# EAGLE design S0_2te3.0a (EAGLE 5.06)
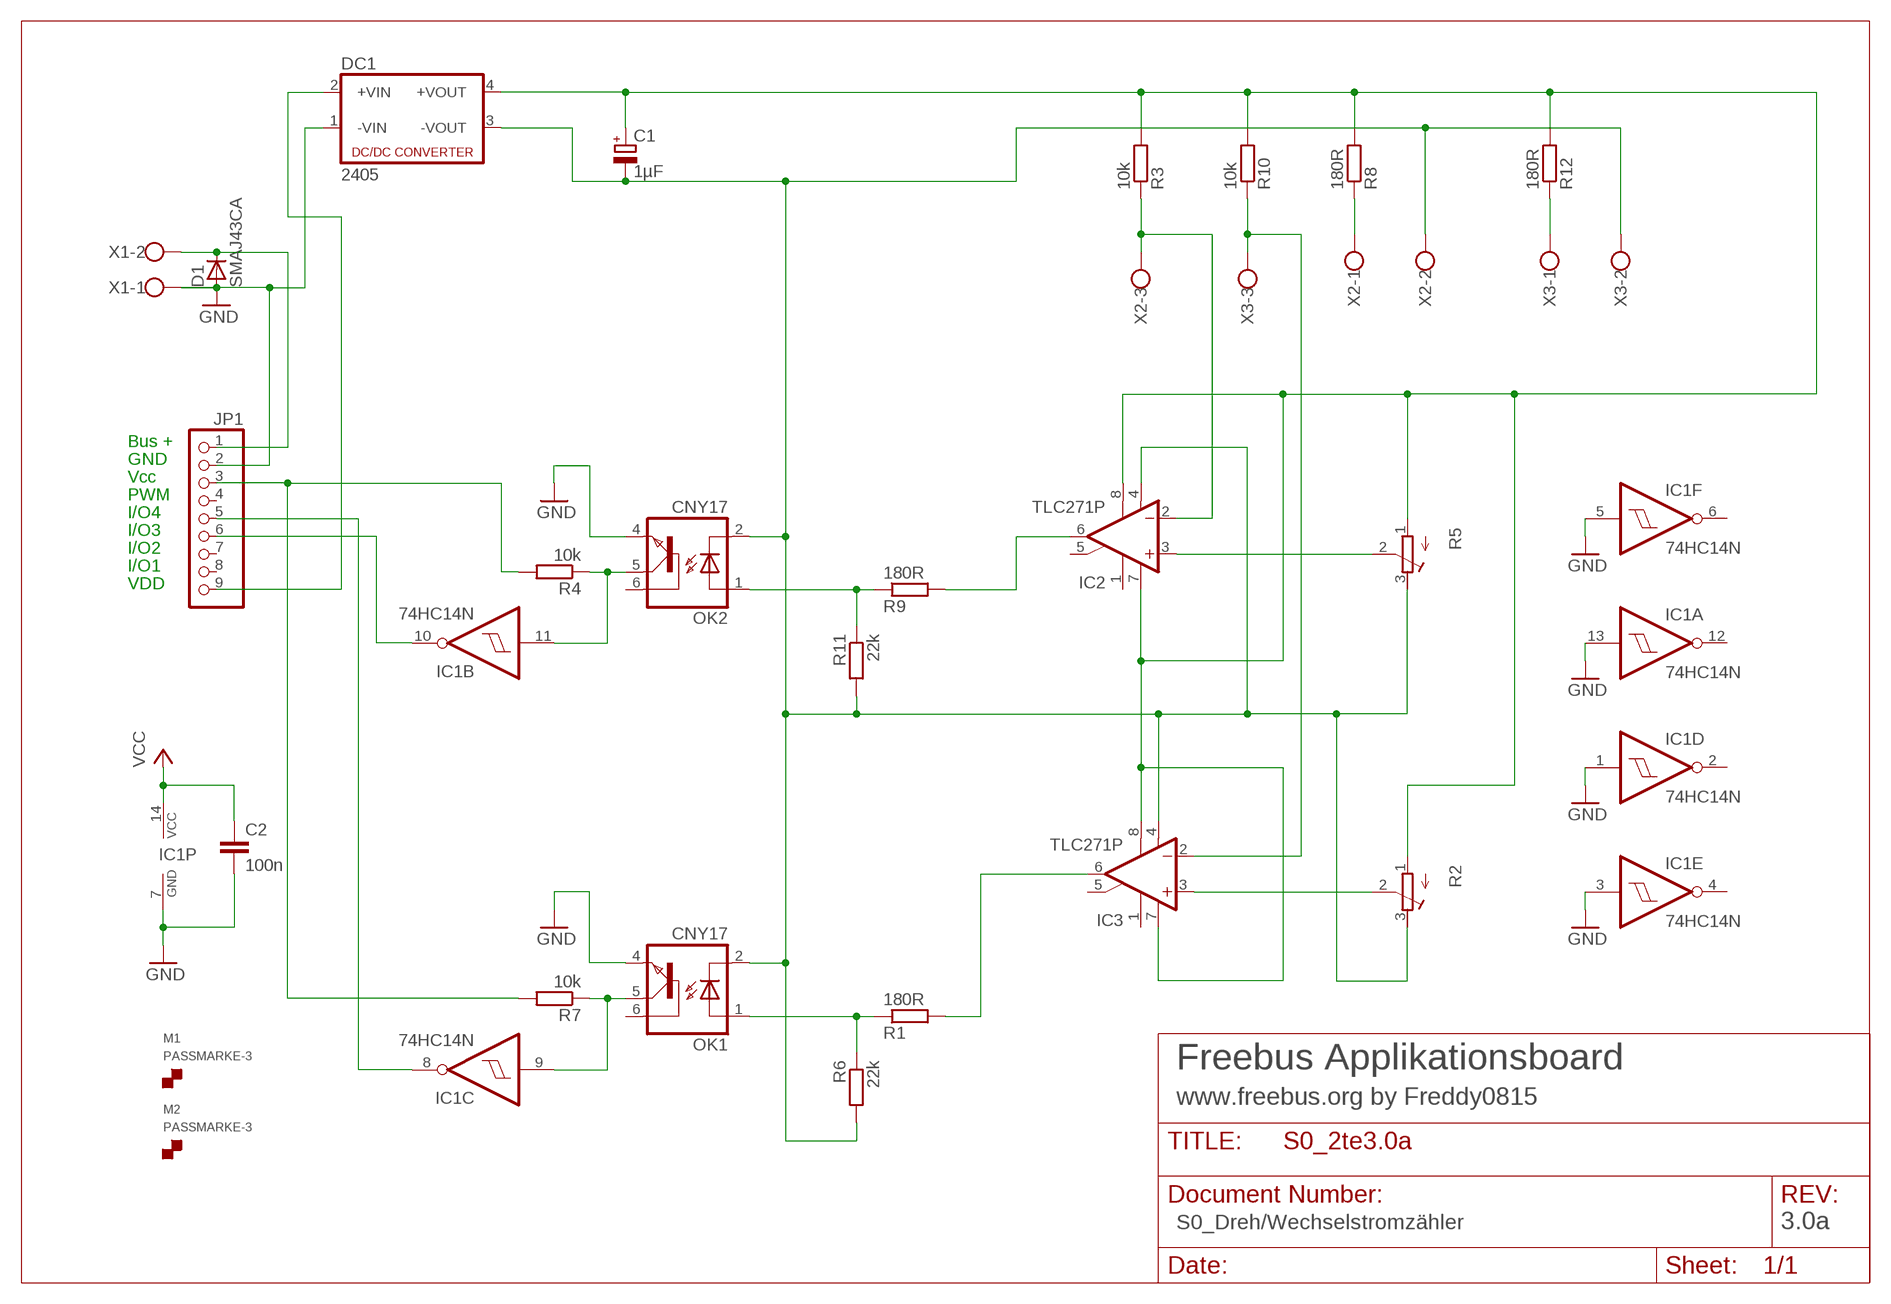
[diagram p0: schematic, sheet 1]

## Parts
C1  1µF  CPOL-EUE2-5  [E2-5]
C2  100n  C-EU025-024X044  [C025-024X044]
D1  SMAJ43CA  D-SMB  [SMB]
DC1  2405  VA-2405S  [4SIL]
IC1  74HC14N  [DIL14]
IC2  TLC271P  [DIL08]
IC3  TLC271P  [DIL08]
JP1  PINHD-1X9  [1X09]
M1  PASSMARKE-3  [PASSMARKE-3]
M2  PASSMARKE-3  [PASSMARKE-3]
OK1  CNY17  [DIL06]
OK2  CNY17  [DIL06]
R1  180R  R-EU_0204/7  [0204/7]
R2  R-TRIMM64Z  [RTRIM64Z]
R3  10k  R-EU_0204/7  [0204/7]
R4  10k  R-EU_0204/7  [0204/7]
R5  R-TRIMM64Z  [RTRIM64Z]
R6  22k  R-EU_0204/7  [0204/7]
R7  10k  R-EU_0204/7  [0204/7]
R8  180R  R-EU_0204/7  [0204/7]
R9  180R  R-EU_0204/7  [0204/7]
R10  10k  R-EU_0204/7  [0204/7]
R11  22k  R-EU_0204/7  [0204/7]
R12  180R  R-EU_0204/7  [0204/7]
X1  W237-02P  [W237-132]
X2  W237-3E  [W237-3E]
X3  W237-3E  [W237-3E]

## Nets
EIB+: D1.1(C) JP1.1 X1.2
GND: C2.2 D1.2(A) DC1.1(-VIN) IC1.1(D:I) IC1.3(E:I) IC1.5(F:I) IC1.7(P:GND) IC1.13(A:I) JP1.2 OK1.4(EMI) OK2.4(EMI) X1.1
IO4: IC1.10(B:O) JP1.6
N$1: IC1.9(C:I) OK1.5(COL) R7.1
N$2: OK2.1(A) R9.1 R11.1
N$3: OK1.1(A) R1.1 R6.1
N$4: C1.- DC1.3(-VOUT) IC2.4(V-) IC3.4(V-) OK1.2(C) OK2.2(C) R2.3(A) R5.3(A) R6.2 R11.2 X2.2 X3.2
N$5: IC3.6(OUT) R1.2
N$6: IC2.6(OUT) R9.2
N$7: C1.+ DC1.4(+VOUT) IC2.7(V+) IC2.8(OPT) IC3.7(V+) IC3.8(OPT) R2.1(E) R3.2 R5.1(E) R8.2 R10.2 R12.2
N$8: R8.1 X2.1
N$9: R12.1 X3.1
N$10: DC1.2(+VIN) JP1.9
N$12: IC1.8(C:O) JP1.5
N$14: IC2.2(-IN) R3.1 X2.3
N$15: IC3.2(-IN) R10.1 X3.3
N$17: IC2.3(+IN) R5.2(S)
N$18: IC3.3(+IN) R2.2(S)
N$28: IC1.11(B:I) OK2.5(COL) R4.1
VCC: C2.1 IC1.14(P:VCC) JP1.3 R4.2 R7.2
Unconnected: IC1.2(D:O) IC1.4(E:O) IC1.6(F:O) IC1.12(A:O) IC2.1(ON1) IC2.5(ON2) IC3.1(ON1) IC3.5(ON2) JP1.4 JP1.7 JP1.8 OK1.6(BAS) OK2.6(BAS)

## Notes on the sheet
- Bus +
- GND
- Vcc
- PWM
- I/O4
- I/O3
- I/O2
- I/O1
- VDD
- Freebus Applikationsboard
- www.freebus.org by Freddy0815
- S0_Dreh/Wechselstromzähler | 3.0a

## Library data of the parts
C1 = rcl:CPOL-EU: POLARIZED CAPACITOR, European symbol
C2 = rcl:C-EU: CAPACITOR, European symbol
D1 = semicon-smd-ipc:D-: DIODE unfilled
DC1 = dc-dc-converter:VA-*?: DC DC Converter Single Output, 1 Watt Motien Technology Co.,Ltd. Source: va-serie.pdf
IC1 = 74xx-eu:74*14: Hex schmitt trigger INVERTER
IC2 IC3 = linear:TLC271: OP AMP
JP1 = pinhead:PINHD-1X9: PIN HEADER
M1 M2 = Mechparts:PASSMARKE-3: 000000; 00,00; Passmarke-3 Drill 0,1 mm DRC-Masks-Solder auf 0,4 mm einstellen dadurch werden Holes kleiner 0,4 mm ohne Lötstopmaske generiert. Dies ermöglicht das exakte Anpassen des Stop-Films da die Holes nicht mit dem normalen, vergrösserten Übermass überdeckt werden.
OK1 OK2 = optocoupler:CNY17: SIEMENS OPTO COUPLER
R1 R3 R4 R6-R12 = rcl:R-EU_: RESISTOR, European symbol
R2 R5 = rcl:R-TRIMM: Trimm resistor
X1 = con-wago-508:W237-02P: WAGO SREW CLAMP
X2 X3 = con-wago-508:W237-3E: WAGO SREW CLAMP

## Board
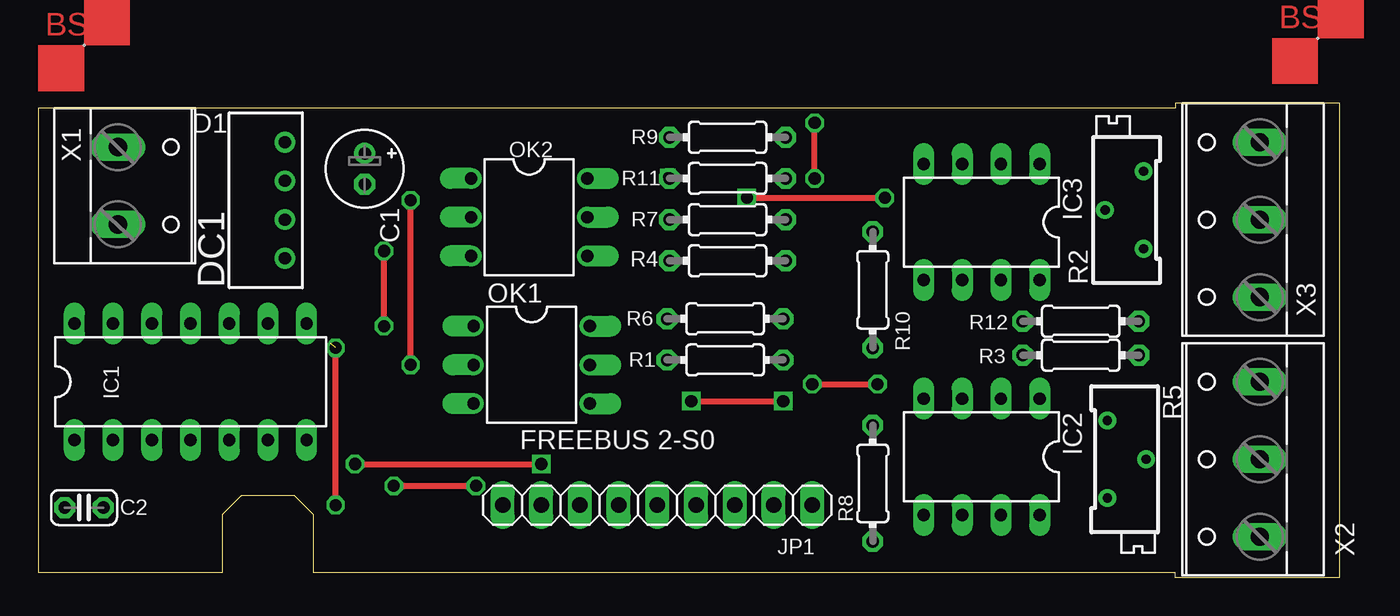
[diagram p1: board, top side]
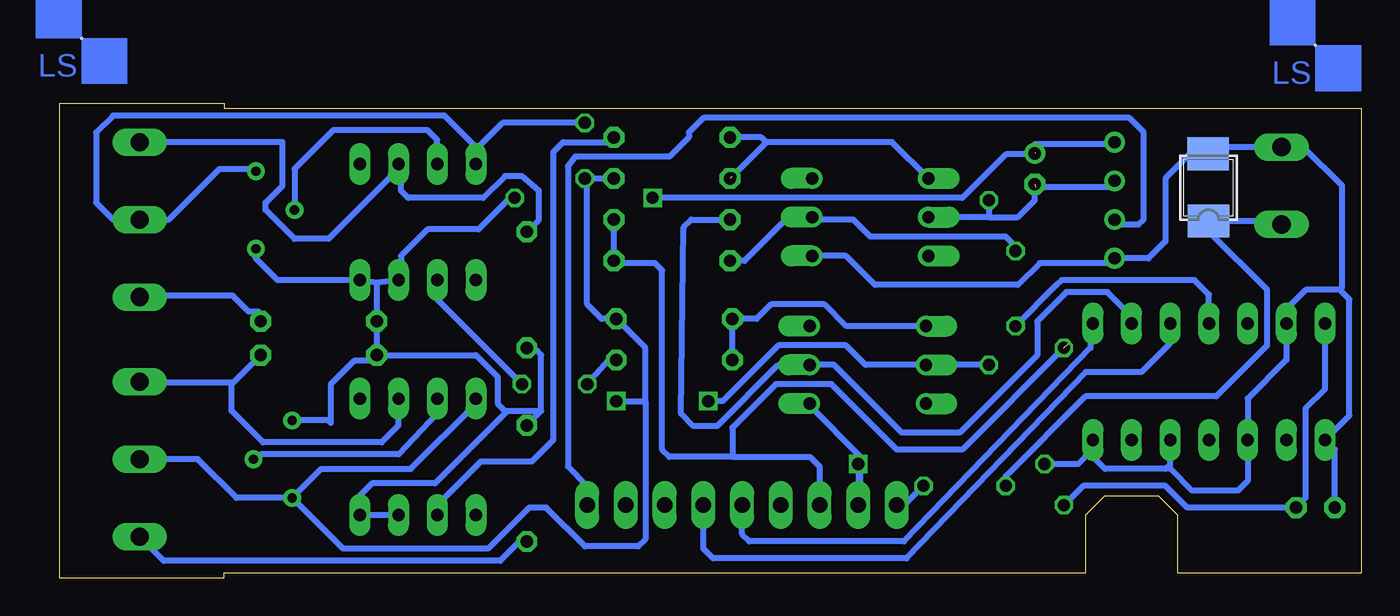
[diagram p2: board, bottom side, seen from below]

Size 85.41 x 31.12 mm. Coordinates in mm from the lower left corner, seen from the top.
Outline: 85.41,0 74.61,0 74.61,0.32 18.1,0.32 18.1,4.13 16.83,5.4 13.33,5.4 12.06,4.13 12.06,0.32 0,0.32 0,30.8 74.61,30.8 74.61,31.12 85.41,31.12 85.41,0
Copper layers (1*16): Top 0.035mm / dielectric 1.5mm / Bottom 0.035mm
Design rules "default_freebus *": minimum track width 10mil, minimum drill 24mil, track to track 8mil, track to pad 8mil, pad to pad 8mil, via to via 8mil, smd to smd 8mil, copper to edge 12mil, drill to drill 8mil, minimum pad ring 11mil, minimum via ring 8mil, stop-mask expansion 4mil, vias tented up to drill 0mil, thermal gap 10mil

### Footprints (pad centres in the part's own frame; a part is rotated, then mirrored left to right if it is on the bottom)
E2-5 = drill 0.813 pad 1.27 round: + -1.016,0 | drill 0.813 pad 1.27 octagon: - 1.016,0
C025-024X044 = drill 0.813 octagon: 1 -1.27,0; 2 1.27,0
SMB = smd 2.159 x 2.743: 1 -2.311,-0.127; 2 2.108,-0.102
4SIL = drill 0.8 round: 1 -3.81,0; 2 -1.27,0; 3 1.27,0; 4 3.81,0
DIL14 = drill 0.813 long: 1 -7.62,-3.81; 2 -5.08,-3.81; 3 -2.54,-3.81; 4 0,-3.81; 5 2.54,-3.81; 6 5.08,-3.81; 7 7.62,-3.81; 8 7.62,3.81; 9 5.08,3.81; 10 2.54,3.81; 11 0,3.81; 12 -2.54,3.81; 13 -5.08,3.81; 14 -7.62,3.81
DIL08 = drill 0.813 long: 1 -3.81,-3.81; 2 -1.27,-3.81; 3 1.27,-3.81; 4 3.81,-3.81; 5 3.81,3.81; 6 1.27,3.81; 7 -1.27,3.81; 8 -3.81,3.81
1X09 = drill 1.016 long: 1 -10.16,0; 2 -7.62,0; 3 -5.08,0; 4 -2.54,0; 5 0,0; 6 2.54,0; 7 5.08,0; 8 7.62,0; 9 10.16,0
PASSMARKE-3 = hole 0.1: 0,0
DIL06 = drill 0.813 offset: 1 -2.54,-3.81; 2 0,-3.81; 3 2.54,-3.81; 4 2.54,3.81; 5 0,3.81; 6 -2.54,3.81
0204/7 = drill 0.813 octagon: 1 -3.81,0; 2 3.81,0
RTRIM64Z = drill 0.61 round: 1 0,-2.54; 2 -2.54,0; 3 0,2.54
W237-132 = drill 1.194 long: 1 -2.54,-0.635; 2 2.54,-0.635
W237-3E = drill 1.194 long: 1 -5.08,-0.635; 2 0,-0.635; 3 5.08,-0.635

### Placement (x,y rotation side)
C1  21.43,26.83 270 top
C2  3.02,4.6 180 top
D1  10.16,25.72 90 bottom
DC1  16.19,24.77 90 top
IC1  10,12.86 0 top
IC2  61.91,7.94 180 top
IC3  61.91,23.34 180 top
JP1  40.64,4.76 0 top
M1  3.02,34.93 0 top  (outside the outline)
M2  83.98,35.4 0 top  (outside the outline)
OK1  32.38,13.97 270 top
OK2  32.23,23.65 270 top
R1  45.09,14.29 0 top
R2  72.55,24.13 0 top
R3  68.42,14.61 180 top
R4  45.24,20.8 0 top
R5  70.17,7.78 180 top
R6  45.09,16.99 0 top
R7  45.24,23.5 0 top
R8  54.77,6.19 90 top
R9  45.24,28.89 0 top
R10  54.77,18.89 270 top
R11  45.24,26.19 0 top
R12  68.42,16.83 180 top
X1  5.87,25.72 270 top
X2  79.53,7.78 90 top
X3  79.53,23.5 90 top

### Tracks (layer width: path | path; a pad name or v marks a point on that pad's centre or on a via)
EIB+  (via drill 0.8)
  Top 0.406: v23.34,6.03 v28.73,6.03
  Bottom 0.406: X1.2 5.47,23.41 D1.1 10,23.37 10,22.7 6.19,18.89 6.19,15.24 9.52,11.91 18.1,11.91 23.34,6.67 v23.34,6.03 | JP1.1 30,4.76 v28.73,6.03
GND  (via drill 0.8)
  Top 0.406: v20.8,7.46 v33.02,7.46
  Bottom 0.406: IC1.1 | 1.43,18.89 3.65,18.89 4.92,17.62 IC1.13 4.92,14.29 7.46,11.75 IC1.3 7.46,6.35 8.1,5.72 11.11,5.72 12.54,7.14 12.54,7.46 | 1.43,18.89 0.79,18.26 0.79,10.64 IC1.1 | 1.43,18.89 1.27,19.05 1.27,25.72 3.81,28.26 X1.1 9.63,28.26 D1.2 10.17,27.94 11.11,27.94 12.86,26.19 12.86,22.07 13.97,20.96 DC1.1 16.19,20.64 21.11,20.64 22.54,19.21 31.91,19.21 33.81,21.11 OK2.4 | 17.62,8.41 17.62,8.1 | v33.02,7.46 JP1.2 32.86,4.92 32.86,7.94 36.19,11.27 OK1.4 | 12.54,7.46 IC1.5 | 17.62,8.41 17.62,7.94 16.83,7.14 12.86,7.14 12.54,7.46 | 17.62,8.41 IC1.7 | C2.2 1.75,8.41 IC1.1 | v20.8,7.46 18.57,7.46 17.78,8.25 17.78,8.26 17.62,8.41
IO4
  Bottom 0.406: IC1.10 12.54,15.4 14.45,13.49 18.1,13.49 29.84,1.27 42.54,1.27 43.18,1.9 JP1.6
N$1
  Bottom 0.406: R7.1 43.97,23.5 44.48,22.99 44.64,10.74 43.85,9.96 42.27,9.96 38.3,13.93 37.46,13.97 OK1.5 34.61,13.97 30.16,9.52 26.35,9.52 21.27,14.6 21.27,16.83 19.37,18.73 16.67,18.73 15.08,17.15 IC1.9 | R7.1
N$2  (via drill 0.6)  (1 unrouted)
  Bottom 0.406: v41.31,26.31 | 39.05,28.57 v41.31,26.31 | 39.05,28.57 30.8,28.57 OK2.1 | R9.1 39.37,28.89 39.05,28.57
N$3
  Bottom 0.406: R1.1 41.27,14.26 41.31,14.22 41.31,16.95 R6.1 39.69,16.99 38.73,17.94 35.24,17.94 33.81,16.51 OK1.1
N$4  (via drill 0.8)  (1 unrouted)
  Top 0.406: v50.96,26.19 v50.96,29.84 | v42.86,11.59 v48.89,11.59 | v24.45,13.97 v24.45,24.77 | R11.2
  Bottom 0.406: 21.4,25.6 16.31,25.6 DC1.3 | 22.02,24.18 21.43,24.77 C1.- | 22.02,24.18 | 22.02,24.18 22.54,23.65 24.45,23.65 | 24.45,23.65 OK2.2 | R5.3 73.82,5.24 76.36,7.78 X2.2 | X2.2 | R2.3 72.71,26.83 74.93,26.83 78.26,23.5 X3.2 81.91,23.5 83.03,24.61 83.03,29.21 81.91,30.32 60.17,30.32 58.1,28.26 58.1,28.1 | 58.1,28.1 IC3.4 | R5.3 | R5.3 66.83,1.9 57.31,1.9 54.61,4.6 53.5,4.6 50.96,2.06 47.47,2.06 46.99,2.54 46.99,11.59 | 46.99,11.59 46.99,15.08 R6.2 49.85,16.99 50.8,17.94 50.8,25.88 | IC2.4 58.1,11.43 62.39,7.14 68.26,7.14 R5.3 | 50.8,25.88 50.48,26.19 R11.2 | 50.8,25.88 50.8,26.35 v50.96,26.19 | v50.96,29.84 56.36,29.84 58.1,28.1 | v48.89,11.59 46.99,11.59 | v24.45,13.97 OK1.2 32.54,13.97 33.81,15.24 38.26,15.24 41.91,11.59 v42.86,11.59 | v24.45,24.77 24.45,23.65
N$5  (via drill 0.8)
  Top 0.406: v50.8,12.7 v55.09,12.7
  Bottom 0.406: R1.2 49.37,14.29 v50.8,12.7 | v55.09,12.7 60.64,18.26 IC3.6 | IC3.6
N$6
  Bottom 0.406: R9.2 49.37,28.57 52.39,28.57 53.02,27.94 53.02,9.05 54.45,7.62 57.78,7.62 60.64,4.76 IC2.6
N$7  (via drill 0.8)  (1 unrouted)
  Top 0.406: v46.51,24.92 v55.56,24.92
  Bottom 0.406: IC2.7 IC2.8 65.72,5.4 64.93,6.19 60.8,6.19 56.12,10.87 | R3.2 64.99,14.22 66.1,14.22 67.63,12.7 67.63,10.16 67.79,10.32 R5.1 | 64.61,19.37 IC3.8 71.12,19.53 72.55,20.95 R2.1 | 64.61,19.37 IC3.7 63.02,20.32 63.02,21.11 61.28,22.86 57.94,22.86 55.88,24.92 v55.56,24.92 | 64.61,19.37 64.61,19.21 R12.2 R3.2 | DC1.4 16.38,28.45 21.4,28.45 21.4,27.88 | v46.51,24.92 26.19,24.92 23.34,27.78 21.49,27.78 C1.+ | IC2.7 | 56.12,10.87 56.04,10.95 53.82,10.95 | 53.82,10.95 R8.2 | R3.2 58.1,14.61 56.67,13.18 56.67,11.43 56.12,10.87 | 53.82,10.95 53.82,14.6 54.13,14.92 54.61,14.92 R10.2
N$8
  Bottom 0.406: R8.1 55.24,2.38 56.51,1.11 78.58,1.11 X2.1
N$9  (via drill 0.6)
  Top 0.406: v80.09,18.49 X3.1
  Bottom 0.406: R12.1 72.39,17.46 73.02,17.46 74.03,18.47 74.03,18.49 v80.09,18.49
N$10
  Bottom 0.406: JP1.9 50.8,6.03 52.07,7.3 52.07,26.99 51.59,27.62 45.4,27.62 44.13,28.89 44.13,29.21 43.18,30.16 15.24,30.16 14.29,29.21 14.29,23.5 14.6,23.18 16.19,23.18 DC1.2
N$12
  Bottom 0.406: JP1.5 40.64,2.86 40.16,2.38 30,2.38 17.78,15.08 17.78,16.51 IC1.8
N$14  (via drill 0.6)
  Top 0.406: v80.11,12.8 X2.3
  Bottom 0.406: 74.03,12.8 v80.11,12.8 | 74.03,12.8 74.03,12.81 R3.1 | IC2.2 63.18,10 64.29,8.89 72.07,8.89 74.14,10.95 74.14,12.69 74.03,12.8
N$15
  Bottom 0.406: X3.3 70.8,28.57 70.8,25.72 71.91,24.61 71.91,24.13 70.01,22.22 67.79,22.22 63.18,26.83 63.18,27.78 IC3.2 63.02,26.99 63.02,25.4 62.55,24.92 57.63,24.92 56.2,26.35 55.09,26.35 53.97,25.4 53.97,23.49 R10.1
N$17
  Bottom 0.406: IC2.3 60.64,10.8 63.18,8.1 72.23,8.1 R5.2
N$18
  Bottom 0.406: R2.2 70.01,26.83 67.47,29.37 61.28,29.37 60.64,28.73 60.64,27.78 IC3.3
N$28  (via drill 0.8)
  Top 0.406: v22.7,16.51 v22.7,21.43
  Bottom 0.406: R4.1 40.48,20.8 37.62,23.65 OK2.5 35.88,23.5 33.34,23.5 32.23,22.38 23.34,22.38 22.7,21.75 v22.7,21.43 | R4.1 | 20,19.21 v22.7,16.51 | 20,19.21 | 20,19.21 19.68,19.53 10.95,19.53 10,18.57 IC1.11 | IC1.11
VCC  (via drill 0.8)  (1 unrouted)
  Top 0.406: v19.53,4.76 v19.53,15.08
  Bottom 0.406: R7.2 R4.2 48.89,20.64 46.35,20.64 45.88,20.16 45.88,8.41 45.4,7.94 41.27,7.94 | 41.27,7.94 36.19,7.94 35.56,7.3 JP1.3 | IC1.14 2.38,12.38 3.65,11.11 3.65,5.24 C2.1 11.43,4.6 12.86,6.03 18.26,6.03 v19.53,4.76 | 41.27,7.94 41.27,9.84 38.42,12.7 34.77,12.7 30.48,8.41 26.19,8.41 v19.53,15.08

### Text on the board
tNames: by Freddy0815 | FREEBUS 2-S0